# Altium schematic sheet [02] - MICROCONTROLADOR.SchDoc
size A4; DocumentNumber: 2; SheetNumber: 2; SheetTotal: 5; Folha: Microcontrolador
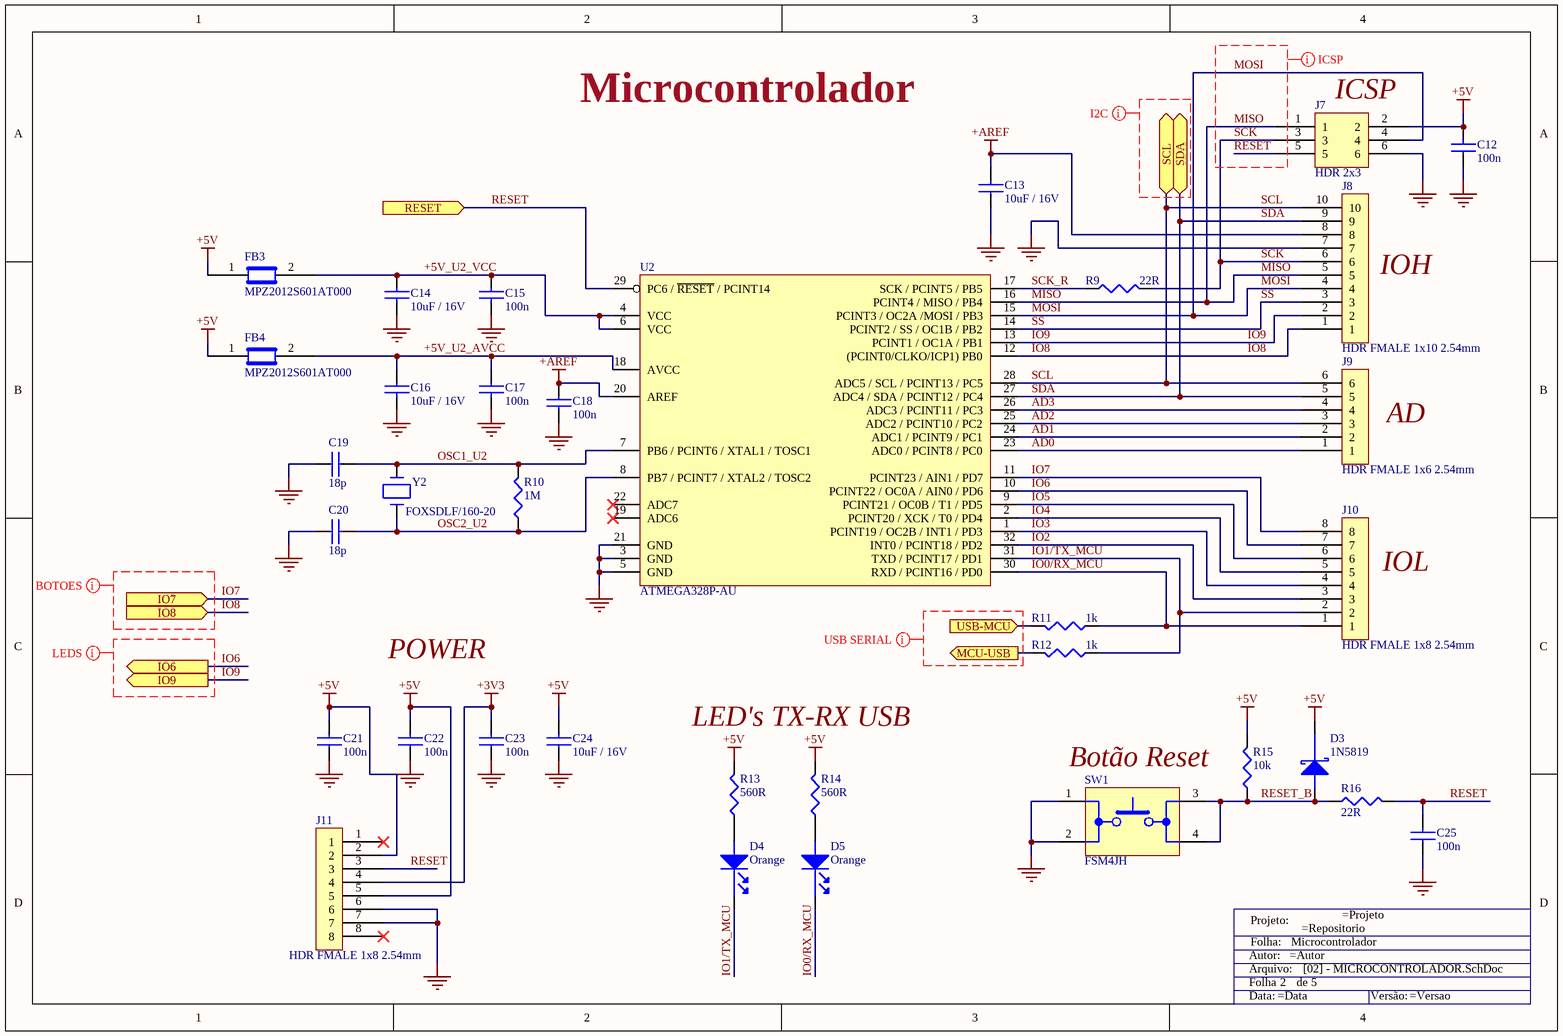
[diagram p0: [02] - MICROCONTROLADOR.SchDoc]

## Parts
C12  100n  [C0805]
C13  10uF / 16V  [C0805]
C14  10uF / 16V  [C0805]
C15  100n  [C0805]
C16  10uF / 16V  [C0805]
C17  100n  [C0805]
C18  100n  [C0805]
C19  18p  [C0805]
C20  18p  [C0805]
C21  100n  [C0805]
C22  100n  [C0805]
C23  100n  [C0805]
C24  10uF / 16V  [C0805]
C25  100n  [C0805]
D3  1N5819  [1N5819]
D4  Orange  [LED_0603]
D5  Orange  [LED_0603]
FB3  MPZ2012S601AT000  [C0805]
FB4  MPZ2012S601AT000  [C0805]
J7  HDR 2x3  [HDR_2x3_2.54MM]
J8  HDR FMALE 1x10 2.54mm  [Hdr_Female_1x10_2.54mm]
J9  HDR FMALE 1x6 2.54mm  [Hdr_Female_1x6_2.54mm]
J10  HDR FMALE 1x8 2.54mm  [Hdr_Female_1x8_2.54mm]
J11  HDR FMALE 1x8 2.54mm  [Hdr_Female_1x8_2.54mm]
R9  22R  [R0805]
R10  1M  [R0805]
R11  1k  [R0805]
R12  1k  [R0805]
R13  560R  [R0805]
R14  560R  [R0805]
R15  10k  [R0805]
R16  22R  [R0805]
SW1  FSM4JH  [FSM4JH]
TitleBlock3  Title Block  (value not drawn)  (graphical)
U2  ATMEGA328P-AU  [TQFP32]
Y2  FOXSDLF/160-20  [HC49SD]

## Ports
IO6 (out), IO7 (in), IO8 (in), IO9 (out), MCU-USB (out), RESET (in), SCL (bidir), SDA (bidir), USB-MCU (in)

## Nets
+3V3: C23.2 J11.4
+5V: C12.2 C21.2 C22.2 C24.2 D3.1(Cathode) FB3.1 FB4.1 J7.2 J11.2 J11.5 R13.2 R14.2 R15.2
+AREF: C13.2 C18.1 J8.8 U2.20(AREF)
GND: C12.1 C13.1 C14.2 C15.2 C16.2 C17.2 C18.2 C19.1 C20.1 C21.1 C22.1 C23.1 C24.1 C25.1 J7.6 J8.7 J11.6 J11.7 SW1.1 SW1.2 U2.3(GND) U2.5(GND) U2.21(GND)
+5V_U2_AVCC: C16.1 C17.1 FB4.2 U2.18(AVCC)
+5V_U2_VCC: C14.1 C15.1 FB3.2 U2.4(VCC) U2.6(VCC)
AD0: J9.1 U2.23(ADC0_/_PCINT8_/_PC0)
AD1: J9.2 U2.24(ADC1_/_PCINT9_/_PC1)
AD2: J9.3 U2.25(ADC2_/_PCINT10_/_PC2)
AD3: J9.4 U2.26(ADC3_/_PCINT11_/_PC3)
IO0/RX_MCU: D5.1(Cathode) J10.1 R11.1 U2.30(RXD_/_PCINT16_/_PD0)
IO1/TX_MCU: D4.1(Cathode) J10.2 R12.1 U2.31(TXD_/_PCINT17_/_PD1)
IO2: J10.3 U2.32(INT0_/_PCINT18_/_PD2)
IO3: J10.4 U2.1(PCINT19_/_OC2B_/_INT1_/_PD3)
IO4: J10.5 U2.2(PCINT20_/_XCK_/_T0_/_PD4)
IO5: J10.6 U2.9(PCINT21_/_OC0B_/_T1_/_PD5)
IO6: J10.7 U2.10(PCINT22_/_OC0A_/_AIN0_/_PD6) ; port IO6
IO7: J10.8 U2.11(PCINT23_/_AIN1_/_PD7) ; port IO7
IO8: J8.1 U2.12((PCINT0/CLKO/ICP1)_PB0) ; port IO8
IO9: J8.2 U2.13(PCINT1_/_OC1A_/_PB1) ; port IO9
MCU-USB: R12.2 ; port MCU-USB
MISO: J7.1 J8.5 U2.16(PCINT4_/_MISO_/_PB4)
MOSI: J7.4 J8.4 U2.15(PCINT3_/_OC2A_/MOSI_/_PB3)
OSC1_U2: C19.2 R10.2 U2.7(PB6_/_PCINT6_/_XTAL1_/_TOSC1) Y2.2
OSC2_U2: C20.2 R10.1 U2.8(PB7_/_PCINT7_/_XTAL2_/_TOSC2) Y2.1
RESET: C25.2 J7.5 J11.3 R16.2 U2.29(PC6_/_~{RESET}_/_PCINT14) ; port RESET
RESET_B: D3.2(Anode) R15.1 R16.1 SW1.3 SW1.4
SCK: J7.3 J8.6 R9.2
SCK_R: R9.1 U2.17(SCK_/_PCINT5_/_PB5)
SCL: J8.10 J9.6 U2.28(ADC5_/_SCL_/_PCINT13_/_PC5) ; port SCL
SDA: J8.9 J9.5 U2.27(ADC4_/_SDA_/_PCINT12_/_PC4) ; port SDA
SS: J8.3 U2.14(PCINT2_/_SS_/_OC1B_/_PB2)
USB-MCU: R11.2 ; port USB-MCU
NetD4_2: D4.2(Anode) R13.1
NetD5_2: D5.2(Anode) R14.1

Not connected (* = marked no-connect by the designer): J11 1* 8*; U2 19(ADC6)* 22(ADC7)*

## Layout directives
net class I2C: (no net found under the mark)
net class USB SERIAL: (no net found under the mark)
net class BOTOES: (no net found under the mark)
net class LEDS: (no net found under the mark)
net class ICSP: MISO, MOSI, RESET, SCK

## Notes on the sheet
- Microcontrolador
- (near J7) ICSP
- (near J8) IOH
- (near J9) AD
- (near J10) IOL
- POWER
- LED's TX-RX USB
- Botão Reset
- (in symbol Title Block) Projeto:; Folha:; Autor:; Arquivo:; Folha; de; Data:; Versão:

## Library data of the parts
C12 C15 C17 C18 C21-C23 C25 = C2012X7R1H104K085AA_1: CAP CER 0.1UF 50V X7R 0805; Manufacturer: TDK Corporation; Capacitance: 0.1µF; Tolerance: ±10%; Supplier 1: Digi-Key; Manufacturer Part Number: C2012X7R1H104K085AA; RoHS: RoHS Compliant; Category: Capacitors; Stock 1: 335513; Pricing 1: 1=0.1, 10=0.066, 100=0.0303, 250=0.02476, 500=0.02118, 1000=0.0165 (USD); Packaging: Cut Tape (CT); Voltage - Rated: 50V; Temperature Coefficient: X7R; Mounting Type: Surface Mount, MLCC; Operating Temperature: -55°C ~ 125°C; Applications: General Purpose; Ratings: -; Package / Case: 0805 (2012 Metric); Size / Dimension: 0.079" L x 0.049" W (2.00mm x 1.25mm); Height - Seated (Max): -; Thickness (Max): 0.037" (0.95mm); Lead Spacing: -; Features: -; Lead Style: -; ComponentLink1URL: https://product.tdk.com/info/en/catalog/datasheets/mlcc_commercial_general_en.pdf; ComponentLink1Description: https://product.tdk.com/info/en/catalog/datasheets/mlcc_commercial_general_en.pdf; Supplier Part Number 1: 445-7534-1-ND
C13 C14 C16 C24 = C2012X5R1C106M125AC: CAP CER 10UF 16V X5R 0805; Manufacturer: TDK Corporation; Capacitance: 10µF; Tolerance: ±20%; Supplier 1: Digi-Key; Manufacturer Part Number: C2012X5R1C106M125AC; RoHS: RoHS Compliant; Category: Capacitors; Stock 1: 72024; Pricing 1: 1=0.33, 10=0.272, 100=0.136, 250=0.102, 500=0.0901, 1000=0.0799 (USD); Packaging: Cut Tape (CT); Voltage - Rated: 16V; Temperature Coefficient: X5R; Mounting Type: Surface Mount, MLCC; Operating Temperature: -55°C ~ 85°C; Applications: General Purpose; Ratings: -; Package / Case: 0805 (2012 Metric); Size / Dimension: 0.079" L x 0.049" W (2.00mm x 1.25mm); Height - Seated (Max): -; Thickness (Max): 0.057" (1.45mm); Lead Spacing: -; Features: -; Lead Style: -; ComponentLink1URL: https://product.tdk.com/info/en/catalog/datasheets/mlcc_commercial_general_en.pdf; ComponentLink1Description: https://product.tdk.com/info/en/catalog/datasheets/mlcc_commercial_general_en.pdf; Supplier Part Number 1: 445-4115-1-ND
C19 C20 = C0805C180J5GACTU: CAP CER 18PF 50V NP0 0805; Manufacturer: Kemet; Tolerance: ±5%; Temperature Coefficient: C0G, NP0; Supplier 1: Digi-Key; Manufacturer Part Number: C0805C180J5GACTU; RoHS: RoHS Compliant; Category: Capacitors; Stock 1: 159749; Pricing 1: 1=0.11, 10=0.082, 50=0.0442, 100=0.0374, 250=0.0306, 500=0.02618, 1000=0.0204 (USD); Packaging: Cut Tape (CT); Capacitance: 18pF; Voltage - Rated: 50V; Mounting Type: Surface Mount, MLCC; Operating Temperature: -55°C ~ 125°C; Applications: General Purpose; Ratings: -; Package / Case: 0805 (2012 Metric); Size / Dimension: 0.079" L x 0.049" W (2.00mm x 1.25mm); Height - Seated (Max): -; Thickness (Max): 0.035" (0.88mm); Lead Spacing: -; Features: -; Lead Style: -; ComponentLink1URL: http://www.kemet.com/docfinder?Partnumber=C0805C180J5GACTU; ComponentLink1Description: http://www.kemet.com/docfinder?Partnumber=C0805C180J5GACTU; Supplier Part Number 1: 399-1112-1-ND
D3 = 1N5819: Schottky Diodes & Rectifiers Schottky Barrier; Manufacturer: ON Semiconductor / Fairchild; Configuration: Single; If - Forward Current: 1 A; Ifsm - Forward Surge Current: 25 A; Ir - Reverse Current: 500 uA; Vf - Forward Voltage: 0.6 V; Vrrm - Repetitive Reverse Voltage: 40 V; Supplier 1: Mouser; Manufacturer Part Number: 1N5819; RoHS: RoHS Compliant; Category: Schottky Diodes & Rectifiers; Stock 1: 19180; Pricing 1: 1=0.380, 10=0.266, 100=0.122, 1000=0.094, 5000=0.080, 10000=0.073, 25000=0.068, 50000=0.061, 100000=0.059 (USD); Height: 2.72 mm (Max); Length: 5.21 mm (Max); Operating Temperature Range: - 65 C to + 125 C; Package / Case: DO-41; Packaging: Cut Tape; Product: Schottky Rectifiers; Series: 1N5819; Technology: Si; Type: Schottky Diode; Width: 2.72 mm (Max); Brand: ON Semiconductor / Fairchild; Mounting Style: Through Hole; Maximum Operating Temperature: + 125 C; Minimum Operating Temperature: - 65 C; Standard Pack Qty: 5000; RoHS - Mouser: Y; Minimum Order Quantity: 1; Reeling: True; ComponentLink1URL: http://www.mouser.com/ds/2/308/1N5819-1118406.pdf; ComponentLink1Description: http://www.mouser.com/ds/2/308/1N5819-1118406.pdf; Supplier Part Number 1: 512-1N5819
D4 D5 = LO L29K-H2K1-24-Z: LED ORANGE DIFFUSED 0603 SMD; Manufacturer: OSRAM Opto Semiconductors Inc.; Lens Color: White; Millicandela Rating: 6.3mcd; Lens Style/Size: Rectangle with Flat Top, 1.30mm x 0.80mm; Voltage - Forward (Vf) (Typ): 1.8V; Current - Test: 2mA; Viewing Angle: 160°; Wavelength - Dominant: 606nm; Wavelength - Peak: 610nm; Supplier 1: Digi-Key; Manufacturer Part Number: LO L29K-H2K1-24-Z; RoHS: RoHS Compliant; Category: Optoelectronics; Stock 1: 3671; Pricing 1: 1=0.42, 10=0.299, 25=0.2456, 100=0.1964, 250=0.14728, 500=0.1339, 1000=0.10712, 2500=0.08703 (USD); Packaging: Cut Tape (CT); Color: Orange; Lens Transparency: Diffused; Mounting Type: Surface Mount; Features: -; Package / Case: 0603 (1608 Metric); Supplier Device Package: *; Size / Dimension: 1.70mm L x 0.80mm W; Height (Max): 0.65mm; ComponentLink1URL: http://www.osram-os.com/Graphics/XPic0/00077105_0.pdf; ComponentLink1Description: http://www.osram-os.com/Graphics/XPic0/00077105_0.pdf; Supplier Part Number 1: 475-2740-1-ND
FB3 FB4 = MPZ2012S601AT000: FERRITE CHIP BEAD 600 OHM SMD; Manufacturer: TDK Corporation; Impedance @ Frequency: 600 Ohm @ 100MHz; Current Rating: 2A; DC Resistance (DCR): 100 mOhm Max; Filter Type: Differential Mode - Single; Supplier 1: Digi-Key; Manufacturer Part Number: MPZ2012S601AT000; RoHS: RoHS Compliant; Category: Filters; Stock 1: 93838; Pricing 1: 1=0.12, 10=0.101, 100=0.0574, 250=0.04528, 500=0.03824, 1000=0.03221 (USD); Packaging: Cut Tape (CT); Package / Case: 0805 (2012 Metric); Mounting Type: Surface Mount; Height (Max): 0.041" (1.05mm); Size / Dimension: 0.079" L x 0.049" W (2.00mm x 1.25mm); ComponentLink1URL: https://product.tdk.com/info/en/catalog/datasheets/beads_commercial_power_mpz2012_en.pdf; ComponentLink1Description: https://product.tdk.com/info/en/catalog/datasheets/beads_commercial_power_mpz2012_en.pdf; Supplier Part Number 1: 445-2206-1-ND
J7 = 67997-106HLF: CONN HEADER 6POS .100 STR 30AU; Manufacturer: FCI; Connector Type: Header, Unshrouded; Number of Positions: 6; Number of Positions Loaded: All; Pitch: 0.100" (2.54mm); Supplier 1: Digi-Key; Manufacturer Part Number: 67997-106HLF; RoHS: RoHS Compliant; Category: Connectors, Interconnects; Stock 1: 1415; Pricing 1: 1=1.64, 10=1.489, 25=1.3976, 50=1.3368, 100=1.276, 250=1.15444, 500=1.0633, 1000=0.9114, 2500=0.85064 (USD); Packaging: Bulk; Contact Type: Male Pin; Number of Rows: 2; Row Spacing: 0.100" (2.54mm); Contact Mating Length: 0.230" (5.84mm); Mounting Type: Through Hole; Termination: Solder; Fastening Type: -; Features: -; Contact Finish: Gold or Gold, GXT™; Contact Finish Thickness: 30µin (0.76µm); Color: Black; ComponentLink1URL: http://portal.fciconnect.com/Comergent//fci/drawing/67996.pdf; ComponentLink1Description: http://portal.fciconnect.com/Comergent//fci/drawing/67996.pdf; Supplier Part Number 1: 609-3393-ND
J8 = M20-7821046: 10-WAY SIL VERT SOCKET L/FREE; Manufacturer: Harwin Inc.; Connector Type: Receptacle; Number of Positions: 10; Number of Positions Loaded: All; Pitch: 0.100" (2.54mm); Supplier 1: Digi-Key; Manufacturer Part Number: M20-7821046; RoHS: RoHS Compliant; Category: Connectors, Interconnects; Stock 1: 297; Pricing 1: 1=1.28, 23=1.12217, 46=1.05609, 69=1.01203, 115=0.968, 253=0.88, 506=0.792, 1012=0.704, 2507=0.638 (USD); Packaging: Tube; Contact Type: Female Socket; Number of Rows: 1; Row Spacing: -; Mounting Type: Through Hole; Termination: Solder; Fastening Type: -; Features: -; Contact Finish: Tin; Contact Finish Thickness: -; Color: Black; ComponentLink1URL: http://cdn.harwin.com/pdfs/M20-782.pdf; ComponentLink1Description: http://cdn.harwin.com/pdfs/M20-782.pdf; Supplier Part Number 1: 952-1847-ND
J9 = M20-7820646: 06-WAY SIL VERT SOCKET L/FREE; Manufacturer: Harwin Inc.; Connector Type: Receptacle; Number of Positions: 6; Number of Positions Loaded: All; Pitch: 0.100" (2.54mm); Supplier 1: Digi-Key; Manufacturer Part Number: M20-7820646; RoHS: RoHS Compliant; Category: Connectors, Interconnects; Stock 1: 255; Pricing 1: 1=0.96, 38=0.79211, 76=0.75895, 114=0.72596, 266=0.66, 532=0.594, 1026=0.528, 2508=0.4785 (USD); Packaging: Tube; Contact Type: Female Socket; Number of Rows: 1; Row Spacing: -; Mounting Type: Through Hole; Termination: Solder; Fastening Type: -; Features: -; Contact Finish: Tin; Contact Finish Thickness: -; Color: Black; ComponentLink1URL: http://cdn.harwin.com/pdfs/M20-782.pdf; ComponentLink1Description: http://cdn.harwin.com/pdfs/M20-782.pdf; Supplier Part Number 1: 952-1809-ND
J10 J11 = M20-7820842: 08-WAY SIL VERT SOCKET L/FREE; Manufacturer: Harwin Inc.; Connector Type: Receptacle; Number of Positions: 8; Number of Positions Loaded: All; Pitch: 0.100" (2.54mm); Supplier 1: Digi-Key; Manufacturer Part Number: M20-7820842; RoHS: RoHS Compliant; Category: Connectors, Interconnects; Stock 1: 0; Pricing 1: 1=1.1, 29=0.91207, 58=0.87397, 116=0.83603, 261=0.76, 522=0.684, 1015=0.608, 2523=0.551 (USD); Packaging: Tube; Contact Type: Female Socket; Number of Rows: 1; Row Spacing: -; Mounting Type: Through Hole; Termination: Solder; Fastening Type: -; Features: -; Contact Finish: Gold; Contact Finish Thickness: Flash; Color: Black; ComponentLink1URL: http://cdn.harwin.com/pdfs/M20-782.pdf; ComponentLink1Description: http://cdn.harwin.com/pdfs/M20-782.pdf; Supplier Part Number 1: 952-1823-ND
R9 R16 = RC0805FR-0722RL: RES SMD 22 OHM 1% 1/8W 0805; Manufacturer: Yageo; Resistance (Ohms): 22; Power (Watts): 0.125W, 1/8W; Temperature Coefficient: ±100ppm/°C; Supplier 1: Digi-Key; Manufacturer Part Number: RC0805FR-0722RL; RoHS: RoHS Compliant; Category: Resistors; Stock 1: 106658; Pricing 1: 1=0.1, 10=0.021, 25=0.0152, 100=0.0084, 250=0.00644, 500=0.00514, 1000=0.00379, 2500=0.00329 (USD); Packaging: Cut Tape (CT); Tolerance: ±1%; Composition: Thick Film; Features: Moisture Resistant; Operating Temperature: -55°C ~ 155°C; Package / Case: 0805 (2012 Metric); Supplier Device Package: 0805; Size / Dimension: 0.079" L x 0.049" W (2.00mm x 1.25mm); Height: 0.024" (0.60mm); Number of Terminations: 2; ComponentLink1URL: http://www.yageo.com/NewPortal/yageodocoutput?fileName=/pdf/R-Chip/PYu-RC_Group_51_RoHS_L_3.pdf; ComponentLink1Description: http://www.yageo.com/NewPortal/yageodocoutput?fileName=/pdf/R-Chip/PYu-RC_Group_51_RoHS_L_3.pdf; Supplier Part Number 1: 311-22.0CRCT-ND
R10 = RC0805FR-071ML: RES SMD 1M OHM 1% 1/8W 0805; Manufacturer: Yageo; Power (Watts): 0.125W, 1/8W; Temperature Coefficient: ±100ppm/°C; Supplier 1: Digi-Key; Manufacturer Part Number: RC0805FR-071ML; RoHS: RoHS Compliant; Category: Resistors; Stock 1: 426248; Pricing 1: 1=0.1, 10=0.021, 25=0.0152, 100=0.0084, 250=0.00644, 500=0.00514, 1000=0.00379, 2500=0.00329 (USD); Packaging: Cut Tape (CT); Resistance (Ohms): 1M; Tolerance: ±1%; Composition: Thick Film; Features: Moisture Resistant; Operating Temperature: -55°C ~ 155°C; Package / Case: 0805 (2012 Metric); Supplier Device Package: 0805; Size / Dimension: 0.079" L x 0.049" W (2.00mm x 1.25mm); Height: 0.024" (0.60mm); Number of Terminations: 2; ComponentLink1URL: http://www.yageo.com/NewPortal/yageodocoutput?fileName=/pdf/R-Chip/PYu-RC_Group_51_RoHS_L_3.pdf; ComponentLink1Description: http://www.yageo.com/NewPortal/yageodocoutput?fileName=/pdf/R-Chip/PYu-RC_Group_51_RoHS_L_3.pdf; Supplier Part Number 1: 311-1.00MCRCT-ND
R11 R12 = RC0805FR-071KL: RES SMD 1K OHM 1% 1/8W 0805; Manufacturer: Yageo; Power (Watts): 0.125W, 1/8W; Temperature Coefficient: ±100ppm/°C; Supplier 1: Digi-Key; Manufacturer Part Number: RC0805FR-071KL; RoHS: RoHS Compliant; Category: Resistors; Stock 1: 2894210; Pricing 1: 1=0.1, 10=0.021, 25=0.0152, 100=0.0084, 250=0.00644, 500=0.00514, 1000=0.00379, 2500=0.00329 (USD); Packaging: Cut Tape (CT); Resistance (Ohms): 1k; Tolerance: ±1%; Composition: Thick Film; Features: Moisture Resistant; Operating Temperature: -55°C ~ 155°C; Package / Case: 0805 (2012 Metric); Supplier Device Package: 0805; Size / Dimension: 0.079" L x 0.049" W (2.00mm x 1.25mm); Height: 0.024" (0.60mm); Number of Terminations: 2; ComponentLink1URL: http://www.yageo.com/NewPortal/yageodocoutput?fileName=/pdf/R-Chip/PYu-RC_Group_51_RoHS_L_3.pdf; ComponentLink1Description: http://www.yageo.com/NewPortal/yageodocoutput?fileName=/pdf/R-Chip/PYu-RC_Group_51_RoHS_L_3.pdf; Supplier Part Number 1: 311-1.00KCRCT-ND
R13 R14 = RC0805FR-07560RL: RES SMD 560 OHM 1% 1/8W 0805; Manufacturer: Yageo; Resistance (Ohms): 560; Power (Watts): 0.125W, 1/8W; Temperature Coefficient: ±100ppm/°C; Supplier 1: Digi-Key; Manufacturer Part Number: RC0805FR-07560RL; RoHS: RoHS Compliant; Category: Resistors; Stock 1: 245556; Pricing 1: 1=0.1, 10=0.021, 25=0.0152, 100=0.0084, 250=0.00644, 500=0.00514, 1000=0.00379, 2500=0.00329 (USD); Packaging: Cut Tape (CT); Tolerance: ±1%; Composition: Thick Film; Features: Moisture Resistant; Operating Temperature: -55°C ~ 155°C; Package / Case: 0805 (2012 Metric); Supplier Device Package: 0805; Size / Dimension: 0.079" L x 0.049" W (2.00mm x 1.25mm); Height: 0.024" (0.60mm); Number of Terminations: 2; ComponentLink1URL: http://www.yageo.com/NewPortal/yageodocoutput?fileName=/pdf/R-Chip/PYu-RC_Group_51_RoHS_L_3.pdf; ComponentLink1Description: http://www.yageo.com/NewPortal/yageodocoutput?fileName=/pdf/R-Chip/PYu-RC_Group_51_RoHS_L_3.pdf; Supplier Part Number 1: 311-560CRCT-ND
R15 = RC0805FR-0710KL: RES SMD 10K OHM 1% 1/8W 0805; Manufacturer: Yageo; Power (Watts): 0.125W, 1/8W; Temperature Coefficient: ±100ppm/°C; Supplier 1: Digi-Key; Manufacturer Part Number: RC0805FR-0710KL; RoHS: RoHS Compliant; Category: Resistors; Stock 1: 4526802; Pricing 1: 1=0.1, 10=0.021, 25=0.0152, 100=0.0084, 250=0.00644, 500=0.00514, 1000=0.00379, 2500=0.00329 (USD); Packaging: Cut Tape (CT); Resistance (Ohms): 10k; Tolerance: ±1%; Composition: Thick Film; Features: Moisture Resistant; Operating Temperature: -55°C ~ 155°C; Package / Case: 0805 (2012 Metric); Supplier Device Package: 0805; Size / Dimension: 0.079" L x 0.049" W (2.00mm x 1.25mm); Height: 0.024" (0.60mm); Number of Terminations: 2; ComponentLink1URL: http://www.yageo.com/NewPortal/yageodocoutput?fileName=/pdf/R-Chip/PYu-RC_Group_51_RoHS_L_3.pdf; ComponentLink1Description: http://www.yageo.com/NewPortal/yageodocoutput?fileName=/pdf/R-Chip/PYu-RC_Group_51_RoHS_L_3.pdf; Supplier Part Number 1: 311-10.0KCRCT-ND
SW1 = FSM4JH: Tactile Switches SPST OFF-(ON) Round pushbutton; Manufacturer: TE Connectivity / Alcoswitch; Current Rating: 50 mA; Operating Force: 1.6 N; Voltage Rating DC: 12 VDC; Ground Terminal: No; Mounting Direction: Vertical; Supplier 1: Mouser; Manufacturer Part Number: FSM4JH; RoHS: RoHS Compliant; Category: Tactile Switches; Stock 1: 42422; Pricing 1: 1=0.100, 25=0.075, 50=0.069, 100=0.066, 250=0.063, 500=0.058, 1000=0.054, 2000=0.051, 5000=0.050 (USD); Actuator: Round; Contact Form: SPST; Packaging: Bulk; Switch Function: OFF - (ON); Termination Style: Solder Pin; Brand: TE Connectivity / Alcoswitch; Mounting Style: Through Hole; Standard Pack Qty: 750; RoHS - Mouser: Y; Minimum Order Quantity: 1; Reeling: False; ComponentLink1URL: http://www.mouser.com/ds/2/418/NG_CD_1825910_C9-679020.pdf; ComponentLink1Description: http://www.mouser.com/ds/2/418/NG_CD_1825910_C9-679020.pdf; Supplier Part Number 1: 506-FSM4JH
U2 = ATMEGA328P-AU: 8-bit Microcontrollers - MCU 32KB In-system Flash 20MHz 1.8V-5.5V; Manufacturer: Microchip Technology / Atmel; Data RAM Size: 2 kB; Data RAM Type: SRAM; Data ROM Size: 1 kB; Data ROM Type: EEPROM; Interface Type: I2C, SPI, USART; Number of I/Os: 23 I/O; ADC Resolution: 10 bit; Core: AVR; Data Bus Width: 8 bit; Number of ADC Channels: 8; Number of Timers/Counters: 3 Timer; Operating Supply Voltage: 1.8 V to 5.5 V; Processor Series: megaAVR; Supply Voltage - Max: 5.5 V; Supply Voltage - Min: 1.8 V; Supplier 1: Mouser; Manufacturer Part Number: ATMEGA328P-AU; RoHS: RoHS Compliant; Category: 8-bit Microcontrollers - MCU; Stock 1: 28109; Pricing 1: 1=2.07, 25=1.89, 100=1.72, 1000=1.64 (USD); Height: 1 mm; Length: 7 mm; Package / Case: TQFP-32; Packaging: Tray; Product: MCU; Program Memory Type: Flash; Series: ATMEGA328; Width: 7 mm; Brand: Microchip Technology / Atmel; Mounting Style: SMD/SMT; Program Memory Size: 32 kB; Maximum Clock Frequency: 20 MHz; Maximum Operating Temperature: + 85 C; Minimum Operating Temperature: - 40 C; Moisture Sensitive: Yes; Standard Pack Qty: 250; Tradename: ATMEGA; RoHS - Mouser: Y; Minimum Order Quantity: 1; Reeling: False; ComponentLink1URL: http://www.mouser.com/ds/2/268/atmel-8271-8-bit-avr-microcontroller-atmega48a-48p-1065900.pdf; ComponentLink1Description: http://www.mouser.com/ds/2/268/atmel-8271-8-bit-avr-microcontroller-atmega48a-48p-1065900.pdf; Supplier Part Number 1: 556-ATMEGA328P-AU
Y2 = FOXSDLF/160-20: Crystals 16MHz 20pF; Manufacturer: Fox; Frequency Stability: 50 PPM; Supplier 1: Mouser; Manufacturer Part Number: FOXSDLF/160-20; RoHS: RoHS Compliant; Category: Crystals; Stock 1: 1632; Pricing 1: 1=0.270, 10=0.225, 50=0.203, 100=0.180, 500=0.171, 1000=0.144, 2000=0.135, 5000=0.130, 10000=0.126 (USD); Frequency: 16 MHz; Height: 4.5 mm; Length: 13.9 mm; Load Capacitance: 20 pF; Package / Case: HC-49/US; Packaging: Cut Tape; Series: FOXSDLF; Termination Style: SMD/SMT; Tolerance: 50 PPM; Width: 5 mm; Brand: Fox; Mounting Style: SMD/SMT; Maximum Operating Temperature: + 70 C; Minimum Operating Temperature: - 10 C; Standard Pack Qty: 1000; RoHS - Mouser: Y; Minimum Order Quantity: 1; Reeling: True; ComponentLink1URL: http://www.mouser.com/ds/2/160/C4SD-1131563.pdf; ComponentLink1Description: http://www.mouser.com/ds/2/160/C4SD-1131563.pdf; Supplier Part Number 1: 559-FOXSD160-20-LF